# Altium project Isolation_Board_L1.PrjPcb
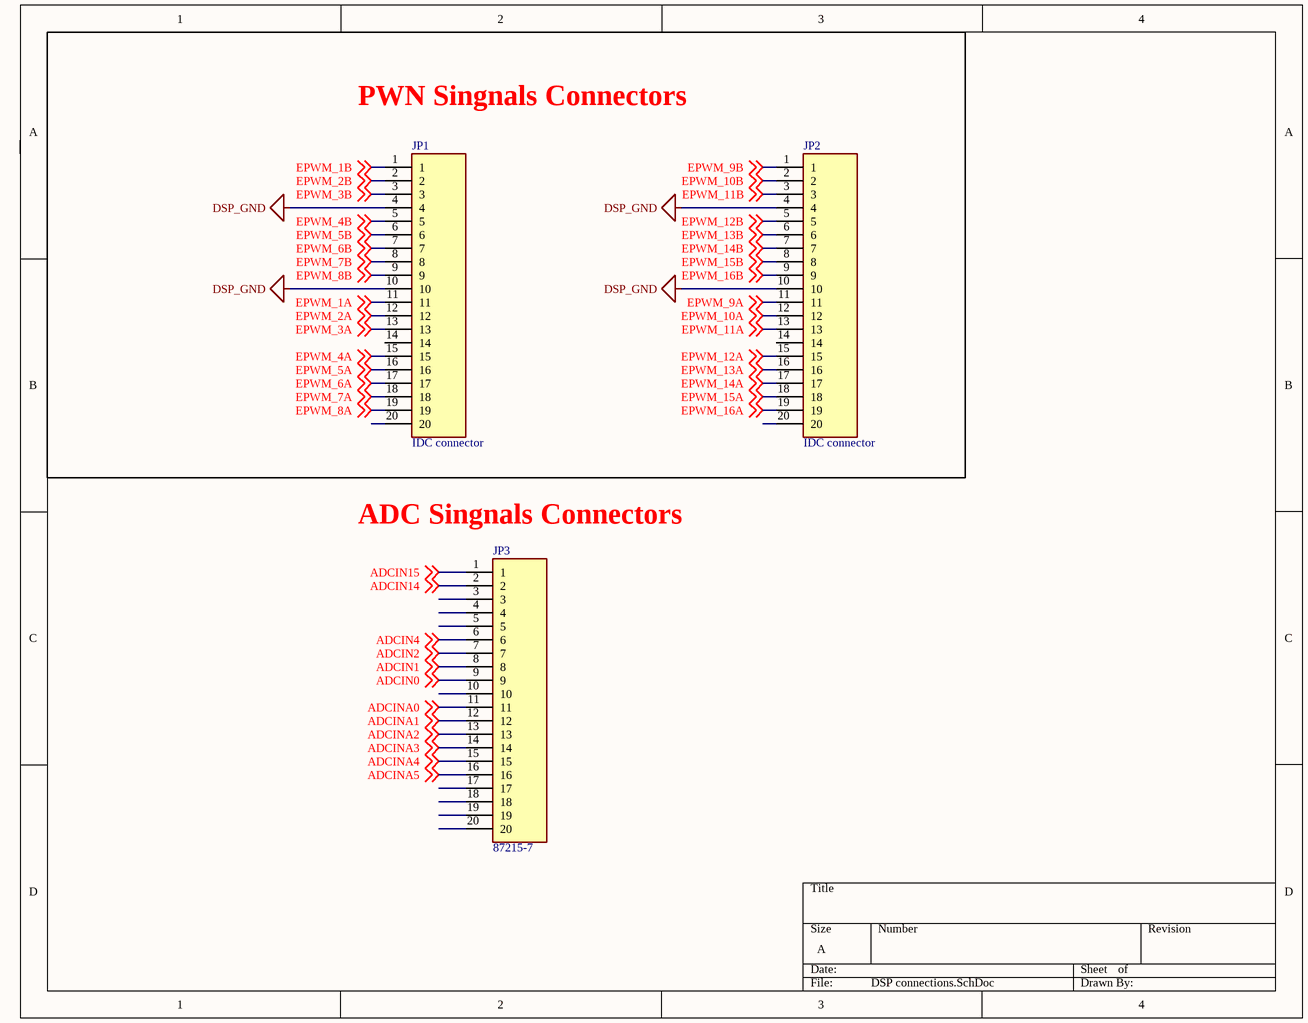
[diagram p0: DSP connections.SchDoc]
7 sheets, 128 parts. Net scope: global (net labels, ports and power ports of the same name join across sheets).
Board file: Isolation_Board.PcbDoc
Sheets:
  Assembly.SchDoc
  DSP connections.SchDoc
  Buck_Converters.SchDoc
  Voltage_Protection.SchDoc
  ADC_LEVEL_SHIFT.SchDoc
  Opto-Isolation_1.SchDoc
  Opto-Isolation_2.SchDoc

## Sheet Assembly.SchDoc
size A3; SheetNumber: 1; SheetTotal: 7

## Sheet DSP connections.SchDoc
size A; SheetNumber: 2; SheetTotal: 6

### Parts
JP1  IDC connector  [TE_87215-7]
JP2  IDC connector  [TE_87215-7]
JP3  87215-7  [TE_87215-7]

### Blocks framed on the sheet
PWN Singnals Connectors: JP1 JP2

### Nets
DSP_GND: JP1.4 JP1.10 JP2.4 JP2.10
ADCIN0: JP3.9 ; off-sheet ADCIN0
ADCIN1: JP3.8 ; off-sheet ADCIN1
ADCIN2: JP3.7 ; off-sheet ADCIN2
ADCIN4: JP3.6 ; off-sheet ADCIN4
ADCIN14: JP3.2 ; off-sheet ADCIN14
ADCIN15: JP3.1 ; off-sheet ADCIN15
ADCINA0: JP3.11 ; off-sheet ADCINA0
ADCINA1: JP3.12 ; off-sheet ADCINA1
ADCINA2: JP3.13 ; off-sheet ADCINA2
ADCINA3: JP3.14 ; off-sheet ADCINA3
ADCINA4: JP3.15 ; off-sheet ADCINA4
ADCINA5: JP3.16 ; off-sheet ADCINA5
EPWM_1A: JP1.11 ; off-sheet EPWM_1A
EPWM_1B: JP1.1 ; off-sheet EPWM_1B
EPWM_2A: JP1.12 ; off-sheet EPWM_2A
EPWM_2B: JP1.2 ; off-sheet EPWM_2B
EPWM_3A: JP1.13 ; off-sheet EPWM_3A
EPWM_3B: JP1.3 ; off-sheet EPWM_3B
EPWM_4A: JP1.15 ; off-sheet EPWM_4A
EPWM_4B: JP1.5 ; off-sheet EPWM_4B
EPWM_5A: JP1.16 ; off-sheet EPWM_5A
EPWM_5B: JP1.6 ; off-sheet EPWM_5B
EPWM_6A: JP1.17 ; off-sheet EPWM_6A
EPWM_6B: JP1.7 ; off-sheet EPWM_6B
EPWM_7A: JP1.18 ; off-sheet EPWM_7A
EPWM_7B: JP1.8 ; off-sheet EPWM_7B
EPWM_8A: JP1.19 ; off-sheet EPWM_8A
EPWM_8B: JP1.9 ; off-sheet EPWM_8B
EPWM_9A: JP2.11 ; off-sheet EPWM_9A
EPWM_9B: JP2.1 ; off-sheet EPWM_9B
EPWM_10A: JP2.12 ; off-sheet EPWM_10A
EPWM_10B: JP2.2 ; off-sheet EPWM_10B
EPWM_11A: JP2.13 ; off-sheet EPWM_11A
EPWM_11B: JP2.3 ; off-sheet EPWM_11B
EPWM_12A: JP2.15 ; off-sheet EPWM_12A
EPWM_12B: JP2.5 ; off-sheet EPWM_12B
EPWM_13A: JP2.16 ; off-sheet EPWM_13A
EPWM_13B: JP2.6 ; off-sheet EPWM_13B
EPWM_14A: JP2.17 ; off-sheet EPWM_14A
EPWM_14B: JP2.7 ; off-sheet EPWM_14B
EPWM_15A: JP2.18 ; off-sheet EPWM_15A
EPWM_15B: JP2.8 ; off-sheet EPWM_15B
EPWM_16A: JP2.19 ; off-sheet EPWM_16A
EPWM_16B: JP2.9 ; off-sheet EPWM_16B

Not connected (* = marked no-connect by the designer): JP1 14 20; JP2 14 20; JP3 3 4 5 10 17 18 19 20

### Notes on the sheet
- (near JP3) ADC Singnals Connectors

### Library data of the parts
JP1-JP3 = 87215-7: 20 MODII HDR DRST UNSHRD .100; MF: TE Connectivity; Value: *; Price: None; Availability: Unavailable; SnapEDA_Link: https://www.snapeda.com/parts/87215-7/TE%20Connectivity/view-part/283412/?ref=snap; Package: None; MP: 87215-7

## Sheet Buck_Converters.SchDoc
size A; SheetNumber: 2; SheetTotal: 6
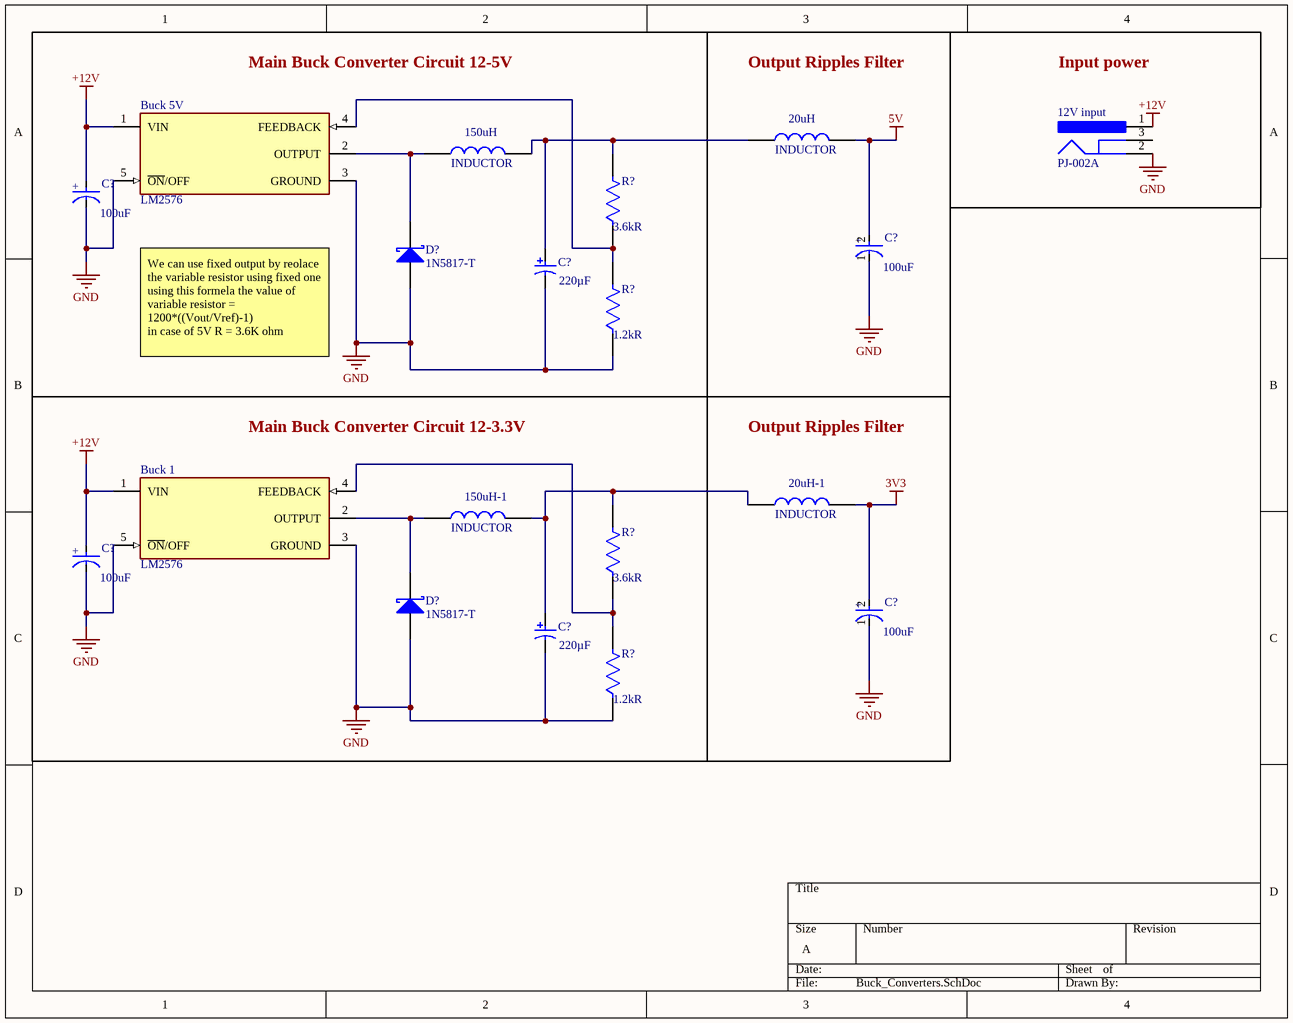
[diagram p1: Buck_Converters.SchDoc]

### Parts
(Parts that share a designator on the sheet are numbered #1, #2 ... from top to bottom, then left to right.)
12V_input  PJ-002A  [CUI-PJ-002A_V]
20uH  INDUCTOR  [AXIAL0.3]
20uH-1  INDUCTOR  [AXIAL0.3]
150uH  INDUCTOR  [AXIAL0.3]
150uH-1  INDUCTOR  [AXIAL0.3]
Buck_1  LM2576  [FP-C04-036-MFG]
Buck_5V  LM2576  [FP-C04-036-MFG]
C?#1  Capacitance: 100uF  [FP-RAD-TH-D_6_3_0_5-L_7_1-MFG]  (hidden comment: ECEA1CKA101I)
C?#2  Capacitance: 100uF  [FP-RAD-TH-D_6_3_0_5-L_7_1-MFG]  (hidden comment: ECEA1CKA101I)
C?#3  Capacitance: 220µF  [PNSC-ECA-1VM221-2]  (hidden comment: ECA-1VM221)
C?#4  Capacitance: 100uF  [FP-RAD-TH-D_6_3_0_5-L_7_1-MFG]  (hidden comment: ECEA1CKA101I)
C?#5  Capacitance: 100uF  [FP-RAD-TH-D_6_3_0_5-L_7_1-MFG]  (hidden comment: ECEA1CKA101I)
C?#6  Capacitance: 220µF  [PNSC-ECA-1VM221-2]  (hidden comment: ECA-1VM221)
D?#1  1N5817-T  [DIOD-DO-41-P-2]
D?#2  1N5817-T  [DIOD-DO-41-P-2]
R?#1  Resistance: 3.6kR  [FP-MRS25-MFG]  (hidden comment: MRS25000C1001FCT00)
R?#2  Resistance: 1.2kR  [FP-MRS25-MFG]  (hidden comment: MRS25000C1001FCT00)
R?#3  Resistance: 3.6kR  [FP-MRS25-MFG]  (hidden comment: MRS25000C1001FCT00)
R?#4  Resistance: 1.2kR  [FP-MRS25-MFG]  (hidden comment: MRS25000C1001FCT00)

### Nets
3V3: 20uH-1.2 C?#5.2(A)
5V: 20uH.2 C?#2.2(A)
+12V: 12V_input.1 Buck_1.1(VIN) Buck_5V.1(VIN) C?#1.2(A) C?#4.2(A)
GND: 12V_input.2 Buck_1.3(GROUND) Buck_1.5(~{ON}/OFF) Buck_5V.3(GROUND) Buck_5V.5(~{ON}/OFF) C?#1.1(C) C?#2.1(C) C?#3.2 C?#4.1(C) C?#5.1(C) C?#6.2 D?#1.1(A) D?#2.1(A) R?#2.1 R?#4.1
Net20uH-1_1: 20uH-1.1 150uH-1.2 C?#6.1 R?#3.2
Net20uH_1: 20uH.1 150uH.2 C?#3.1 R?#1.2
Net150uH-1_1: 150uH-1.1 Buck_1.2(OUTPUT) D?#2.2(K)
Net150uH_1: 150uH.1 Buck_5V.2(OUTPUT) D?#1.2(K)
NetBuck_1_4: Buck_1.4(FEEDBACK) R?#3.1 R?#4.2
NetBuck_5V_4: Buck_5V.4(FEEDBACK) R?#1.1 R?#2.2

Not connected (* = marked no-connect by the designer): 12V_input 3

### Notes on the sheet
- Main Buck Converter Circuit 12-5V
- Output Ripples Filter
- Input power
- We can use fixed output by reolace the variable resistor using fixed one
  using this formela the value of variable resistor = 1200*((Vout/Vref)-1)
  in case of 5V R = 3.6K ohm
- Main Buck Converter Circuit 12-3.3V
- (in symbol CMP-05427-001316-1) +

### Library data of the parts
12V_input = CMP-2000-06895-2: Through Hole Right Angle DC Power Jack, 2.5 A, 2 mm Center Pin, 3 Position, -25 to 85 degC, RoHS, Bulk; Manufacturer: CUIInc.; Brand: CUI; Inside Contact Diameter: 2mm; Voltage Rating: 24V; Outside Contact Diameter: 6.5mm; Current Rating: 2.5A; Insulation Resistance: 50MOhms; Contact Gender: Male; Connector Type: DCPowerJack; Datasheet Version: Rev. 1.03, 04/2016; Housing Material: PolybutyleneTerephthalate(PBT); Operating Temperature Range: -25Cto+85C; Termination Style: ThroughHole; Product Category: DCPowerConnectors; Mounting Technology: ThroughHole; Mounting Style: ThroughHole; Factory Pack Quantity: 500; Contact Plating: Nickel; Package Reference: PJ-002A; Mounting Angle: Right; Package Description: 3-Pin Through Hole Device, Body 14.4 x 9 mm, Height 11 mm; Flammability Rating: UL94V-0; Manufacturer URL: http://www.cui.com/; Product: Jacks; Contact Material: Copper; Datasheet URL: http://www.cui.com/product/resource/pj-002a.pdf; RoHS: True
Buck_1 Buck_5V = CMP-06325-000071-1: IC REG BUCK 5V 3A TO220-5; Min Input Voltage: 4V; Switching Frequency: 52kHz; Efficiency: 82%; Number of Outputs: 1; Output Type: Fixed; Output Configuration: Positive; Max Input Voltage: 40V; Synchronous Rectifier: No; Nominal Output Voltage: 5V; Number of Pins: 5; Lead Free: Lead Free; Width: 4.83mm; Min Operating Temperature: -40°C; Switching Frequency-Max: 52kHz; Mount: Through Hole; Package Quantity: 50; Max Operating Temperature: 85°C; Output Current: 3A; Height: 9.17mm; Radiation Hardening: No; Case/Package: TO-220; Output Voltage: 5V; RoHS Compliant: Yes; Length: 10.67mm; Series: -; Min Output Voltage: 5V; Packaging: Rail/Tube; Max Output Current: 3A; Reach SVHC Compliant: Yes
C?#1 C?#2 C?#4 C?#5 = CMP-05427-001316-1: Aluminum Electrolytic Capacitors (Radial Lead Type) 100uF ±20% 16V; Life (Hours): 1000Hour; Lead Diameter: 0.45mm; Polarity: Polar; Ripple Current: 91mA; Series: KA; Packaging: Tape and Reel; Voltage Rating: 16V; Voltage Rating (DC): 16V; Min Operating Temperature: -40°C; Lead Pitch: 2.5mm; Mount: Through Hole; Height - Seated (Max): 0.315inch; Package Quantity: 2000; Length: 7mm; Termination: Radial; Voltage: 16V; Diameter: 6.3mm; Height: 7mm; Radiation Hardening: No; RoHS Compliant: Yes; Tolerance: 20%; Case/Package: Radial; Max Operating Temperature: 85°C
C?#3 C?#6 = CMP-2000-05311-1: Aluminum Electrolytic Capacitor, 220 uF, +/- 20%, 35 V, -40 to 85 degC, 2-Pin THD, RoHS, Bulk; Manufacturer: Panasonic; Lifetime@Temperature: 2000Hrs@85degC; Rated Voltage: 35V; Ripple Current: 350mA; Type: Radial; Package Reference: ECA-1VM221; Series: M; Operating Temp Range: -40to+85degC; Package Description: 2-Pin Axial Lead, Dia 8 mm, Body Length 12.5 mm; Datasheet Version: Mar-06; Datasheet URL: https://datasheet.ciiva.com/26341/441851-da-01-en-elko-eca1vm221-m-r-220myf-35v-85c-26341906.pdf; Operating Temp-Max: 85degC; Case Size/Dimension: Ø8x11.5mm; Manufacturer URL: http://www.panasonic.com/
D?#1 D?#2 = CMP-2000-05521-1: Schottky Barrier Rectifier, 1 A, 20 V, -65 to 125 degC, 2-Pin DO-41, RoHS, Tape and Reel; Manufacturer: DiodesIncorporated; Vrrm - Repetitive Reverse Voltage: 20V; If - Forward Current: 1A; Configuration: Single; Unit Weight: 0.010582oz; Type: SchottkyDiode; Ifsm - Forward Surge Current: 25A; Vf - Forward Voltage: 0.75Vat3A; Ir - Reverse Current: 1000uA; Technology: Si; Length: 5.21mm; Product: SchottkyRectifiers; Package Reference: DO-41-P-2; Package / Case: DO-41; Datasheet URL: http://www.diodes.com/_files/datasheets/ds23001.pdf; Operating Temperature Range: -65Cto+125C; Mounting Style: ThroughHole; Manufacturer URL: http://www.diodes.com/; Series: 1N58; Minimum Operating Temperature: -65C; Height: 2.72mm; Brand: DiodesIncorporated; Maximum Operating Temperature: +125C; Datasheet Version: Rev. 8-2, 05/2009; Factory Pack Quantity: 5000; Width: 2.72mm; RoHS: True; Product Category: SchottkyDiodes&Rectifiers; Package Description: 2-Pin Through Hole Device, Body 4.635 x 2.36 mm, Pin Spacing 7.85 mm; Packaging: Reel; Termination Style: ThroughHole; Mounting Technology: ThroughHole
R?#1-R?#4 = CMP-02408-000051-1: RES 1K OHM 0.6W 1% AXIAL; Power Rating: 600mW; Lead Diameter: 0.6mm; Voltage Rating (DC): 350V; Temperature Coefficient: 50ppm/°C; Width: 2.5mm; Military Standard: Not; Package Quantity: 5000; Radiation Hardening: No; Case/Package: Axial; Resistance Tolerance: 1%; Resistor Type: Metal Film; Contact Plating: Tin; Length: 6.5mm; Lead Free: Lead Free; RoHS Compliant: Yes; Mount: Through Hole; Number of Pins: 2; Technology: THIN FILM; Voltage Rating: 350V; Min Operating Temperature: -55°C; Weight: 0.00776oz; Diameter: 2.5mm; Construction: Cylindrical; Series: MRS25; Tolerance: 1%; Packaging: Tape and Reel; Max Operating Temperature: 155°C; Max Power Dissipation: 600mW; Number of Terminations: 2; Termination: Axial

## Sheet Voltage_Protection.SchDoc
size 381 x 241 mm; SheetNumber: 4; SheetTotal: 6
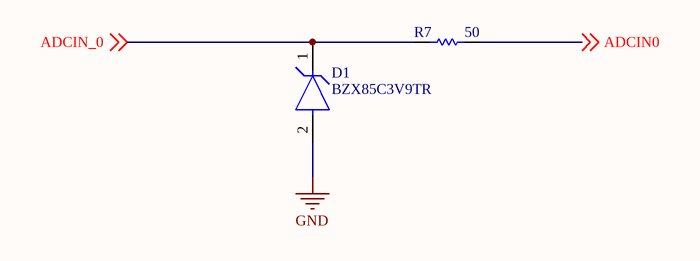
[diagram p2: Voltage_Protection.SchDoc]

### Parts
D1  BZX85C3V9TR  [FP-017AH-MFG]
R7  value 50  (hidden comment: Resistor)

### Nets
GND: D1.2(A)
ADCIN0: R7.2 ; off-sheet ADCIN0
ADCIN_0: D1.1(C) R7.1 ; off-sheet ADCIN_0

### Library data of the parts
D1 = CMP-00278-00328084-1: BZX85C3V9TR Tape & Reel (TR) ±5% Through Hole Single Zener Diode 1.2V @ 200mA 5muA @ 1V 1W 3.9V; NexarPartId: 328084; Zener Current: 60mA; Impedance: 15Ω; Max Reverse Leakage Current: 5µA; Packaging: Tape & Reel; Power Dissipation: 1W; Test Current: 60mA; Tolerance: 5%; Lead Free: Lead Free; Zener Voltage: 3.9V; Voltage Tolerance: 5%; Power Rating: 1W; Number of Pins: 2; Mount: Through Hole; Radiation Hardening: No; Min Operating Temperature: -65°C; Element Configuration: Single; Max Operating Temperature: 200°C; RoHS: Compliant; Voltage Rating (DC): 3.9V; Max Power Dissipation: 1W
R7 = Resistor: TC1: 0; SimulationGenericComponent: True; TC2: 0

## Sheet ADC_LEVEL_SHIFT.SchDoc
size A4; Author: Mostafa_Bakir; SheetNumber: 5; SheetTotal: 6
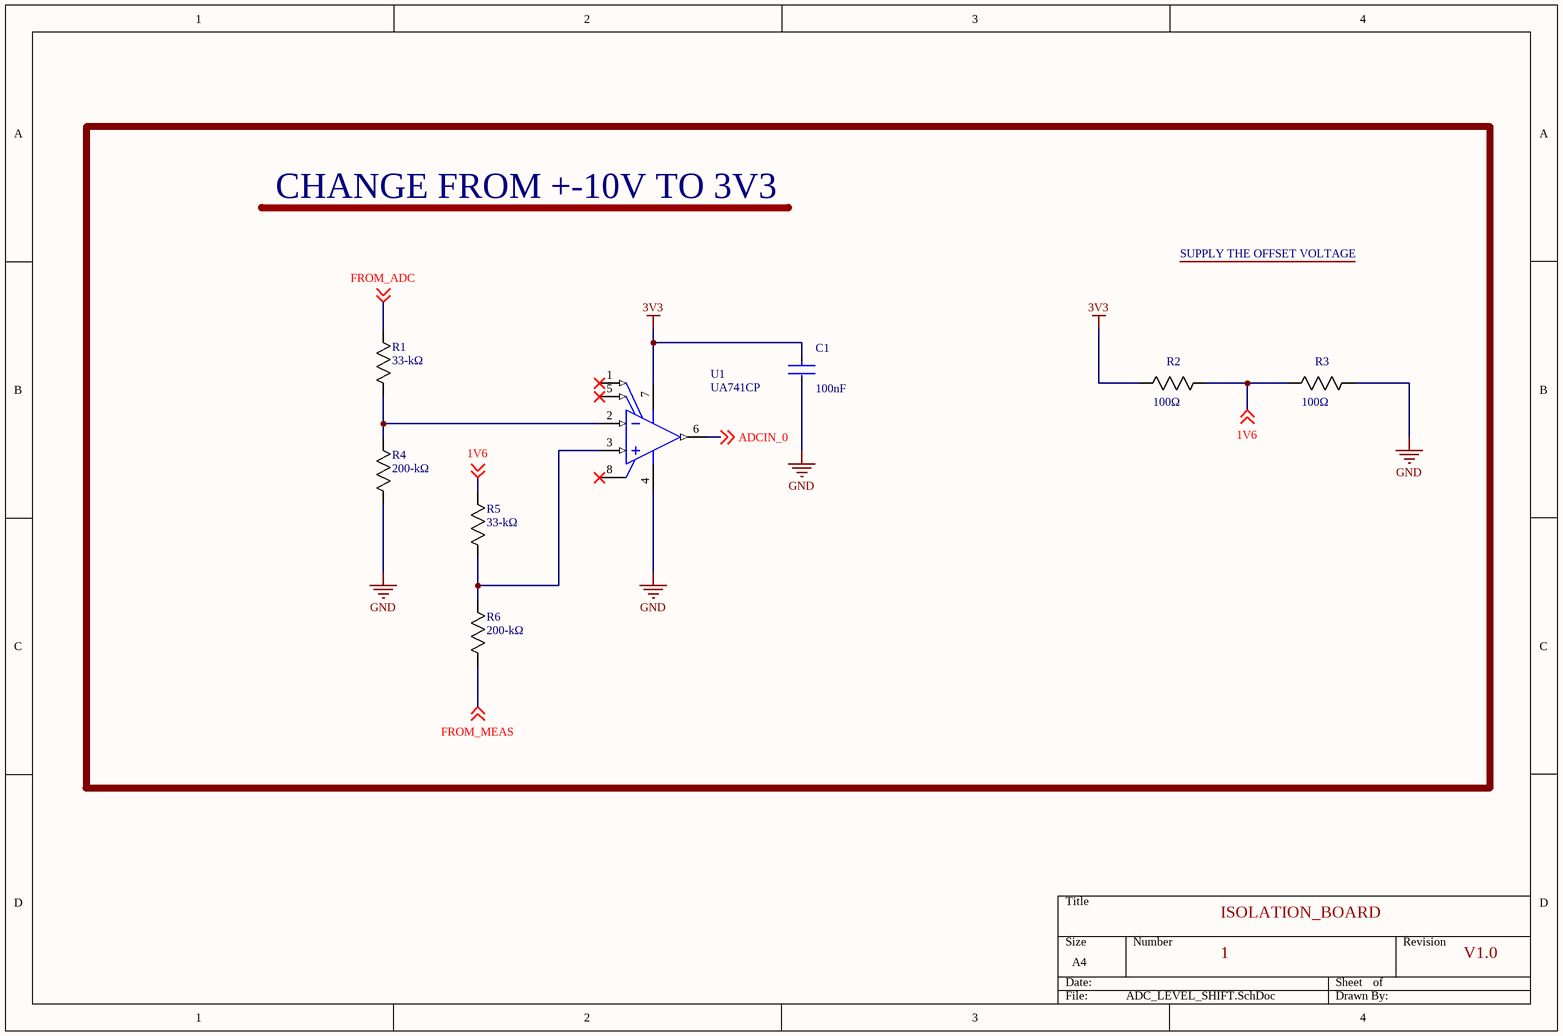
[diagram p3: ADC_LEVEL_SHIFT.SchDoc]

### Parts
C1  Capacitance: 100nF  [FP-K15H5-MFG]  (hidden comment: K104K15X7RF53H5)
R1  Resistance: 33-kΩ  [RES_AC03_VIS]  (hidden comment: AC03000008208JAC00)
R2  Resistance: 100Ω  [RES_AC03_VIS]  (hidden comment: AC03000008208JAC00)
R3  Resistance: 100Ω  [RES_AC03_VIS]  (hidden comment: AC03000008208JAC00)
R4  Resistance: 200-kΩ  [RES_AC03_VIS]  (hidden comment: AC03000008208JAC00)
R5  Resistance: 33-kΩ  [RES_AC03_VIS]  (hidden comment: AC03000008208JAC00)
R6  Resistance: 200-kΩ  [RES_AC03_VIS]  (hidden comment: AC03000008208JAC00)
U1  UA741CP  [P0008A]

### Nets
3V3: C1.1 R2.1 U1.7(VCC+)
GND: C1.2 R3.2 R4.1 U1.4(VCC-)
1V6: R2.2 R3.1 R5.2 ; off-sheet 1V6
ADCIN_0: U1.6(OUT) ; off-sheet ADCIN_0
FROM_ADC: R1.2 ; off-sheet FROM_ADC
FROM_MEAS: R6.1 ; off-sheet FROM_MEAS
NetR1_1: R1.1 R4.2 U1.2(IN-)
NetR5_1: R5.1 R6.2 U1.3(IN+)

Not connected (* = marked no-connect by the designer): U1 1(OFFSET_N1)* 5(OFFSET_N2)* 8(NC)*

### Notes on the sheet
- CHANGE FROM +-10V TO 3V3
- SUPPLY THE OFFSET VOLTAGE
- ISOLATION_BOARD
- 1
- V1.0

### Library data of the parts
C1 = CMP-02417-000048-1: CAP CER 0.1UF 50V X7R RADIAL; Tolerance: 10%; Lead/Base Style: Formed Leads; Lead Length: 30mm; Lead Diameter: 0.5mm; Radiation Hardening: No; Lead Pitch: 5mm; Voltage: 50V; Mount: Through Hole; Package Quantity: 5000; Series: K; Case/Package: Dipped; Min Operating Temperature: -55°C; Depth: 2.5mm; Height - Seated (Max): 0.1inch; Voltage Rating (DC): 50V; Packaging: Bulk; RoHS Compliant: Yes; Construction: RADIAL; Thickness: 2.6mm; Max Operating Temperature: 125°C; Voltage Rating: 50V; Diameter: 500um; Dielectric: X7R; Width: 2.5mm; Length: 4mm; Weight: 0.005644oz; Termination: Radial; Height: 4mm; ComponentLink1Description: BUY; ComponentLink1URL: https://makerselectronics.com/product/ceramic-capacitor-100nf-50v
R1-R6 = CMP-00030-43026420-1: AC03000008208JAC00 AC03 Series Axial Wirewound Resistor 8.2Ohms +/-5% 3W -80 - -10ppm/degC; Tolerance: 5%; Temperature Coefficient: -10ppm/°C; Thickness: 4.8006mm; Radiation Hardening: No; Min Operating Temperature: -40°C; Case/Package: Axial; Packaging: Tape & Box (TB); Termination: Axial; Power Rating: 3W; Width: 4.8006mm; Military Standard: Not; Diameter: 4.8mm; RoHS: Compliant; Contact Plating: Tin; NexarPartId: 43026420; Composition: Wirewound; Features: Flame Retardant Coating; Number of Terminations: 2; Length: 13mm; Max Power Dissipation: 3W; Mount: Through Hole; Max Operating Temperature: 200°C
U1 = CMP-0017-00973-2: General-Purpose Operational Amplifier, 7 to 36 V, 0 to 70 degC, 8-pin DIP (P8), Pb-Free (RoHS); Manufacturer: Texas Instruments; Iq per channel(Max)(mA): 2.8; Number of Channels: 1; Total Supply Voltage(Min)(+5V is 5, +/-5V is 10): 7; IIB(Max)(pA): 800000; Slew Rate(Typ)(V/us): 0.5; Total Supply Voltage(Max)(+5V is 5, +/-5V is 10): 36; Vio (25C)(Max)(mV): 6; CMRR(Min)(dB): 70; Sub Family: General Purpose Amplifier, High Supply Voltage Amplifier (>=30V); PackageVersion: 4040082/E, 04/2010; PackageReference: P0008A; ComponentLink1URL: http://www.ti.com/; Mounting Technology: Through Hole; ComponentLink1Description: Manufacturer URL; GBW(Typ)(MHz): 1; ComponentLink2Description: Datasheet; ComponentLink2URL: http://www.ti.com/lit/ds/symlink/ua741.pdf; PartNumber: UA741CP; Code_JEDEC: MS-001; ComponentLink3Description: Package Specification; DatasheetVersion: SLOS094B; ComponentLink3URL: http://www.ti.com/litv/pdf/mpdi001b; PackageDescription: 8-Pin Plastic In-Line, Body 9.59 x 6.35 mm, Pitch 2.54 mm; Eco-Plan: Pb-Free (RoHS); ComponentLink4Description: BUY; ComponentLink4URL: https://makerselectronics.com/product/ua741

## Sheet Opto-Isolation_1.SchDoc
size A2 portrait; SheetNumber: 6; SheetTotal: 6
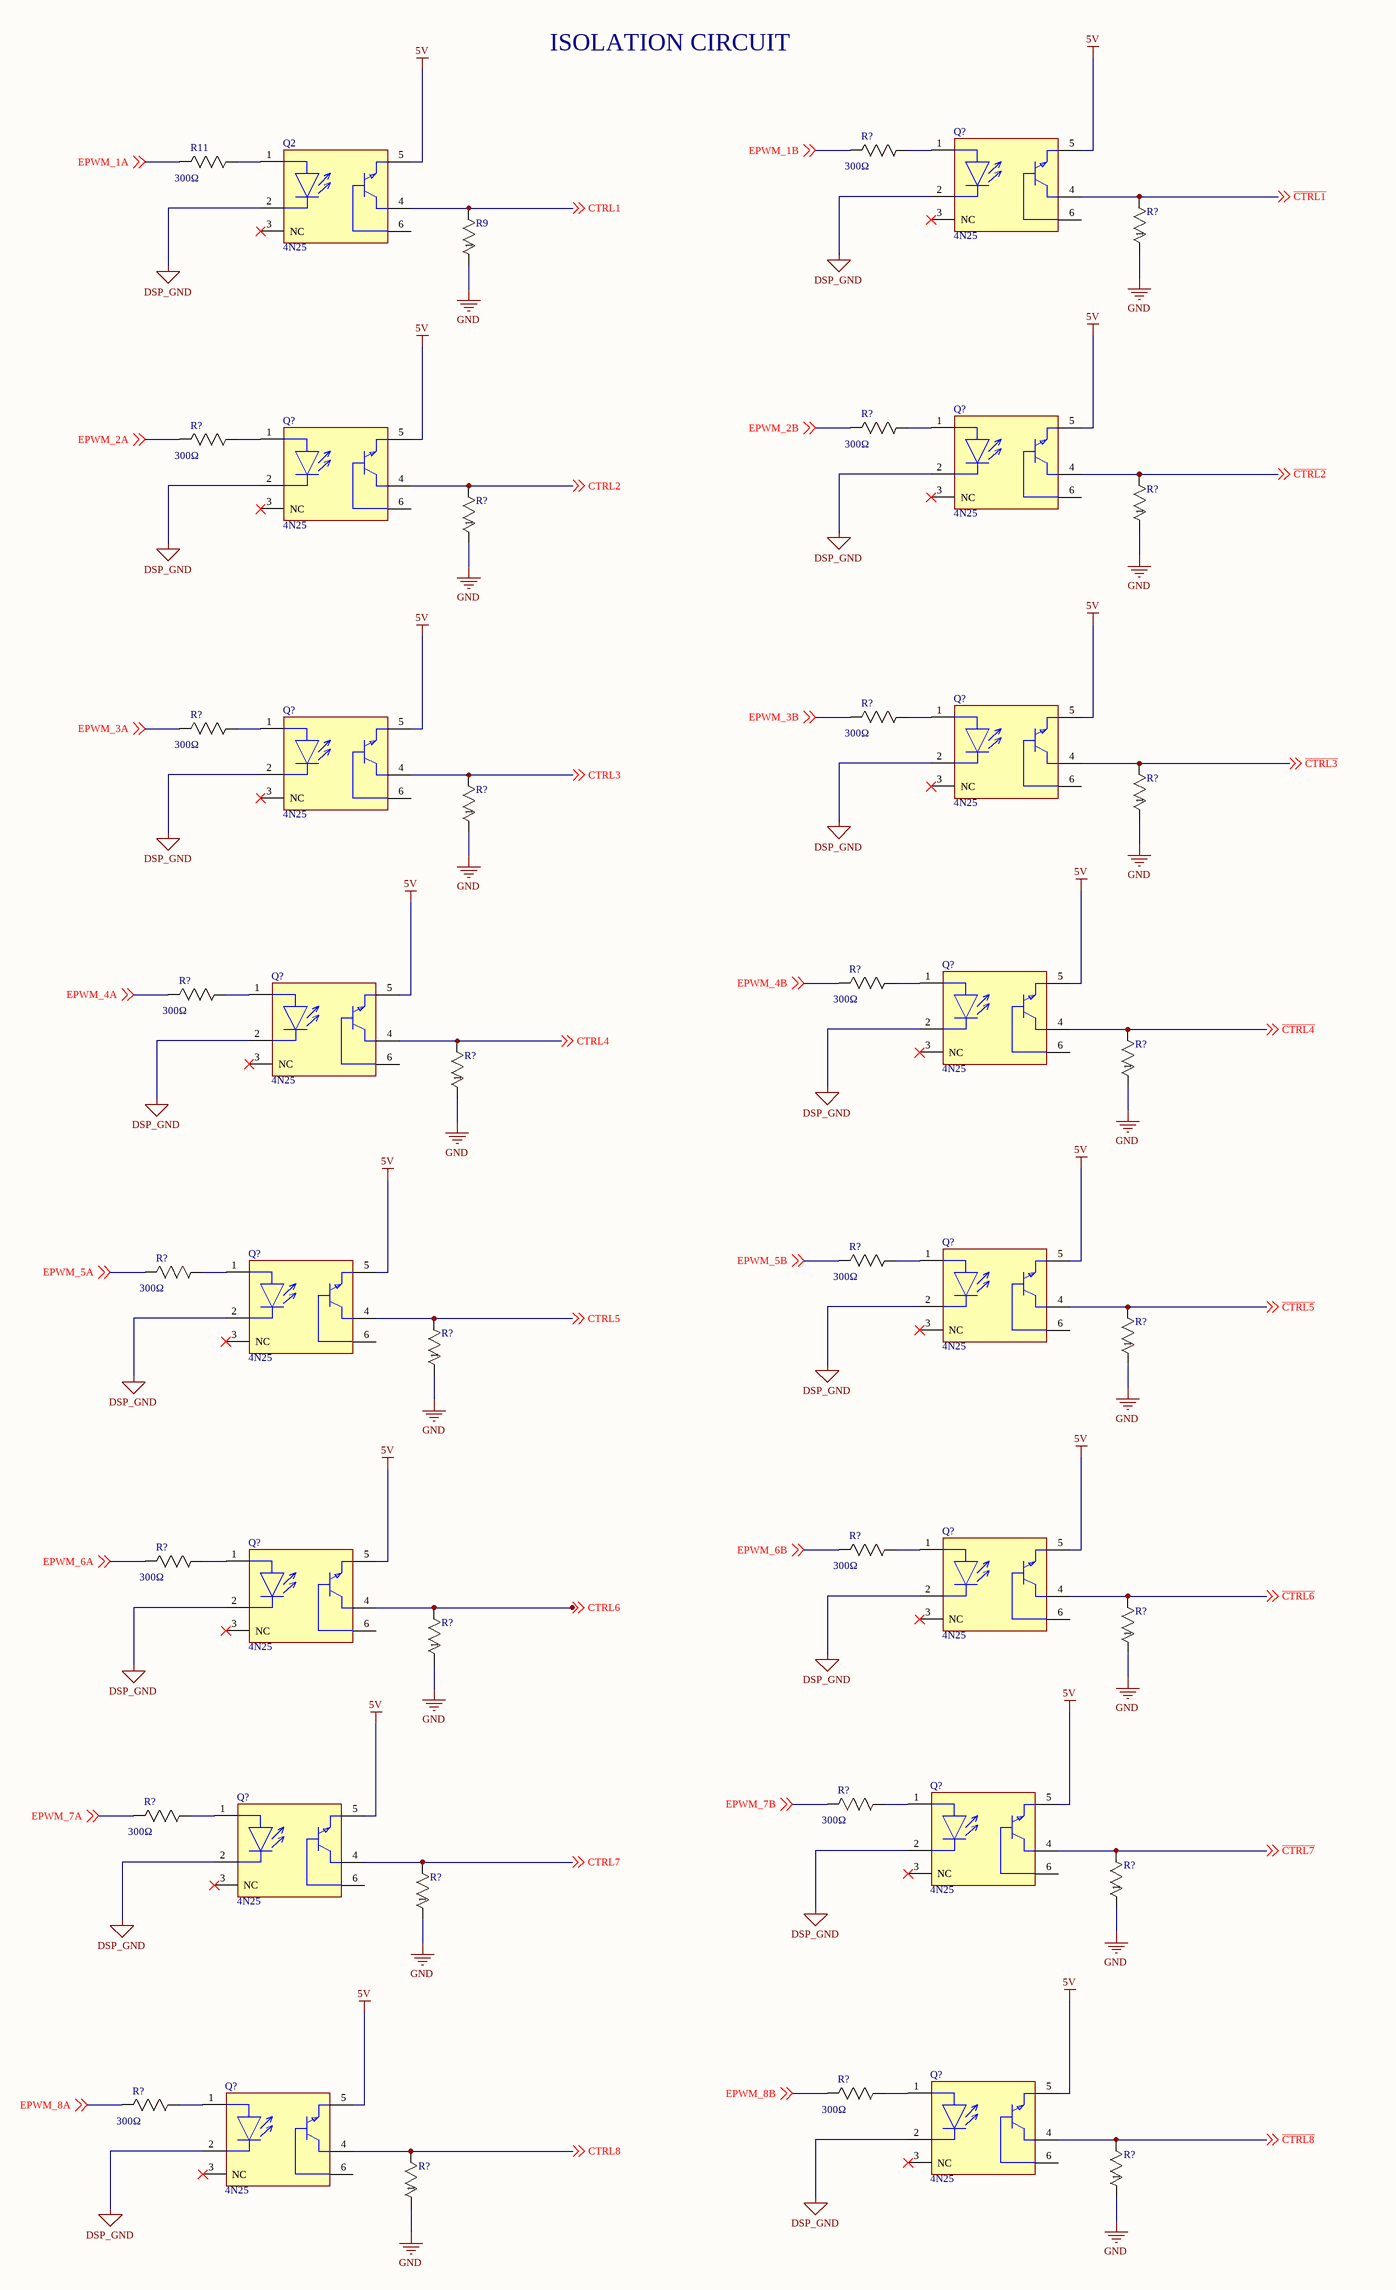
[diagram p4: Opto-Isolation_1.SchDoc]

### Parts
(Parts that share a designator on the sheet are numbered #1, #2 ... from top to bottom, then left to right.)
Q2  4N25  [FP-4N25-MFG]
Q?#1  4N25  [FP-4N25-MFG]
Q?#2  4N25  [FP-4N25-MFG]
Q?#3  4N25  [FP-4N25-MFG]
Q?#4  4N25  [FP-4N25-MFG]
Q?#5  4N25  [FP-4N25-MFG]
Q?#6  4N25  [FP-4N25-MFG]
Q?#7  4N25  [FP-4N25-MFG]
Q?#8  4N25  [FP-4N25-MFG]
Q?#9  4N25  [FP-4N25-MFG]
Q?#10  4N25  [FP-4N25-MFG]
Q?#11  4N25  [FP-4N25-MFG]
Q?#12  4N25  [FP-4N25-MFG]
Q?#13  4N25  [FP-4N25-MFG]
Q?#14  4N25  [FP-4N25-MFG]
Q?#15  4N25  [FP-4N25-MFG]
R9  AC07000001001JAC00  [RES_AC07_VIS]  (value not drawn)
R11  Resistance: 300Ω  [RES_AC03_VIS]  (hidden comment: AC03000003000JAC00)
R?#5  Resistance: 300Ω  [RES_AC03_VIS]  (hidden comment: AC03000003000JAC00)
R?#6  AC07000001001JAC00  [RES_AC07_VIS]  (value not drawn)
R?#7  Resistance: 300Ω  [RES_AC03_VIS]  (hidden comment: AC03000003000JAC00)
R?#8  Resistance: 300Ω  [RES_AC03_VIS]  (hidden comment: AC03000003000JAC00)
R?#9  AC07000001001JAC00  [RES_AC07_VIS]  (value not drawn)
R?#10  AC07000001001JAC00  [RES_AC07_VIS]  (value not drawn)
R?#11  Resistance: 300Ω  [RES_AC03_VIS]  (hidden comment: AC03000003000JAC00)
R?#12  Resistance: 300Ω  [RES_AC03_VIS]  (hidden comment: AC03000003000JAC00)
R?#13  AC07000001001JAC00  [RES_AC07_VIS]  (value not drawn)
R?#14  AC07000001001JAC00  [RES_AC07_VIS]  (value not drawn)
R?#15  Resistance: 300Ω  [RES_AC03_VIS]  (hidden comment: AC03000003000JAC00)
R?#16  Resistance: 300Ω  [RES_AC03_VIS]  (hidden comment: AC03000003000JAC00)
R?#17  AC07000001001JAC00  [RES_AC07_VIS]  (value not drawn)
R?#18  AC07000001001JAC00  [RES_AC07_VIS]  (value not drawn)
R?#19  Resistance: 300Ω  [RES_AC03_VIS]  (hidden comment: AC03000003000JAC00)
R?#20  Resistance: 300Ω  [RES_AC03_VIS]  (hidden comment: AC03000003000JAC00)
R?#21  AC07000001001JAC00  [RES_AC07_VIS]  (value not drawn)
R?#22  AC07000001001JAC00  [RES_AC07_VIS]  (value not drawn)
R?#23  Resistance: 300Ω  [RES_AC03_VIS]  (hidden comment: AC03000003000JAC00)
R?#24  Resistance: 300Ω  [RES_AC03_VIS]  (hidden comment: AC03000003000JAC00)
R?#25  AC07000001001JAC00  [RES_AC07_VIS]  (value not drawn)
R?#26  AC07000001001JAC00  [RES_AC07_VIS]  (value not drawn)
R?#27  Resistance: 300Ω  [RES_AC03_VIS]  (hidden comment: AC03000003000JAC00)
R?#28  Resistance: 300Ω  [RES_AC03_VIS]  (hidden comment: AC03000003000JAC00)
R?#29  AC07000001001JAC00  [RES_AC07_VIS]  (value not drawn)
R?#30  AC07000001001JAC00  [RES_AC07_VIS]  (value not drawn)
R?#31  Resistance: 300Ω  [RES_AC03_VIS]  (hidden comment: AC03000003000JAC00)
R?#32  Resistance: 300Ω  [RES_AC03_VIS]  (hidden comment: AC03000003000JAC00)
R?#33  AC07000001001JAC00  [RES_AC07_VIS]  (value not drawn)
R?#34  AC07000001001JAC00  [RES_AC07_VIS]  (value not drawn)

### Nets
5V: Q2.5(C) Q?#1.5(C) Q?#2.5(C) Q?#3.5(C) Q?#4.5(C) Q?#5.5(C) Q?#6.5(C) Q?#7.5(C) Q?#8.5(C) Q?#9.5(C) Q?#10.5(C) Q?#11.5(C) Q?#12.5(C) Q?#13.5(C) Q?#14.5(C) Q?#15.5(C)
DSP_GND: Q2.2(C) Q?#1.2(C) Q?#2.2(C) Q?#3.2(C) Q?#4.2(C) Q?#5.2(C) Q?#6.2(C) Q?#7.2(C) Q?#8.2(C) Q?#9.2(C) Q?#10.2(C) Q?#11.2(C) Q?#12.2(C) Q?#13.2(C) Q?#14.2(C) Q?#15.2(C)
GND: R9.1 R?#6.1 R?#9.1 R?#10.1 R?#13.1 R?#14.1 R?#17.1 R?#18.1 R?#21.1 R?#22.1 R?#25.1 R?#26.1 R?#29.1 R?#30.1 R?#33.1 R?#34.1
~{CTRL1}: Q?#1.4(E) R?#6.2 ; off-sheet ~{CTRL1}
~{CTRL2}: Q?#2.4(E) R?#9.2 ; off-sheet ~{CTRL2}
~{CTRL3}: Q?#4.4(E) R?#13.2 ; off-sheet ~{CTRL3}
~{CTRL4}: Q?#6.4(E) R?#17.2 ; off-sheet ~{CTRL4}
~{CTRL5}: Q?#8.4(E) R?#21.2 ; off-sheet ~{CTRL5}
~{CTRL6}: Q?#10.4(E) R?#25.2 ; off-sheet ~{CTRL6}
~{CTRL7}: Q?#12.4(E) R?#29.2 ; off-sheet ~{CTRL7}
~{CTRL8}: Q?#14.4(E) R?#33.2 ; off-sheet ~{CTRL8}
CTRL1: Q2.4(E) R9.2 ; off-sheet CTRL1
CTRL2: Q?#3.4(E) R?#10.2 ; off-sheet CTRL2
CTRL3: Q?#5.4(E) R?#14.2 ; off-sheet CTRL3
CTRL4: Q?#7.4(E) R?#18.2 ; off-sheet CTRL4
CTRL5: Q?#9.4(E) R?#22.2 ; off-sheet CTRL5
CTRL6: Q?#11.4(E) R?#26.2 ; off-sheet CTRL6
CTRL7: Q?#13.4(E) R?#30.2 ; off-sheet CTRL7
CTRL8: Q?#15.4(E) R?#34.2 ; off-sheet CTRL8
EPWM_1A: R11.1 ; off-sheet EPWM_1A
EPWM_1B: R?#5.1 ; off-sheet EPWM_1B
EPWM_2A: R?#8.1 ; off-sheet EPWM_2A
EPWM_2B: R?#7.1 ; off-sheet EPWM_2B
EPWM_3A: R?#12.1 ; off-sheet EPWM_3A
EPWM_3B: R?#11.1 ; off-sheet EPWM_3B
EPWM_4A: R?#16.1 ; off-sheet EPWM_4A
EPWM_4B: R?#15.1 ; off-sheet EPWM_4B
EPWM_5A: R?#20.1 ; off-sheet EPWM_5A
EPWM_5B: R?#19.1 ; off-sheet EPWM_5B
EPWM_6A: R?#24.1 ; off-sheet EPWM_6A
EPWM_6B: R?#23.1 ; off-sheet EPWM_6B
EPWM_7A: R?#28.1 ; off-sheet EPWM_7A
EPWM_7B: R?#27.1 ; off-sheet EPWM_7B
EPWM_8A: R?#32.1 ; off-sheet EPWM_8A
EPWM_8B: R?#31.1 ; off-sheet EPWM_8B
NetQ2_1: Q2.1(A) R11.2
NetQ?#1_1: Q?#1.1(A) R?#5.2
NetQ?#2_1: Q?#2.1(A) R?#7.2
NetQ?#3_1: Q?#3.1(A) R?#8.2
NetQ?#4_1: Q?#4.1(A) R?#11.2
NetQ?#5_1: Q?#5.1(A) R?#12.2
NetQ?#6_1: Q?#6.1(A) R?#15.2
NetQ?#7_1: Q?#7.1(A) R?#16.2
NetQ?#8_1: Q?#8.1(A) R?#19.2
NetQ?#9_1: Q?#9.1(A) R?#20.2
NetQ?#10_1: Q?#10.1(A) R?#23.2
NetQ?#11_1: Q?#11.1(A) R?#24.2
NetQ?#12_1: Q?#12.1(A) R?#27.2
NetQ?#13_1: Q?#13.1(A) R?#28.2
NetQ?#14_1: Q?#14.1(A) R?#31.2
NetQ?#15_1: Q?#15.1(A) R?#32.2

Not connected (* = marked no-connect by the designer): Q2 3(NC)* 6(B); Q?#1 3(NC)* 6(B); Q?#2 3(NC)* 6(B); Q?#3 3(NC)* 6(B); Q?#4 3(NC)* 6(B); Q?#5 3(NC)* 6(B); Q?#6 3(NC)* 6(B); Q?#7 3(NC)* 6(B); Q?#8 3(NC)* 6(B); Q?#9 3(NC)* 6(B); Q?#10 3(NC)* 6(B); Q?#11 3(NC)* 6(B); Q?#12 3(NC)* 6(B); Q?#13 3(NC)* 6(B); Q?#14 3(NC)* 6(B); Q?#15 3(NC)* 6(B)

### Notes on the sheet
- ISOLATION CIRCUIT

### Library data of the parts
Q2 Q?#1-Q?#15 = CMP-22018-000009-1: OPTOISO 2.5KV TRANS W/BASE 6DIP; Isolation Voltage: 5kV; Reverse Breakdown Voltage: 5V; Forward Voltage: 1.5V; Rise Time: 2us; Max Power Dissipation: 250mW; Collector Emitter Breakdown Voltage: 30V; Max Collector Current: 100mA; Collector Emitter Saturation Voltage: 500mV; Power Dissipation: 150mW; Number of Elements: 1; Forward Current: 60mA; Output Voltage: 70V; Input Type: DC; Max Input Current: 80mA; Input Current: 50mA; Current Transfer Ratio: 50%; Number of Pins: 6; Min Operating Temperature: -55°C; Radiation Hardening: No; Case/Package: PDIP; Fall Time: 2us; Lead Free: Lead Free; Series: -; Max Operating Temperature: 100°C; Output Current per Channel: 100mA; Number of Circuits: 1; Collector Emitter Voltage (VCEO): 30V; Isolation Voltage-Max: 5kV; Collector-emitter Voltage-Max: 500mV; Packaging: Rail/Tube; Mount: Through Hole; Package Quantity: 2000; Max Output Voltage: 30V; Number of Channels: 1
R9 R?#6 R?#9 R?#10 R?#13 R?#14 R?#17 R?#18 R?#21 R?#22 R?#25 R?#26 R?#29 R?#30 R?#33 R?#34 = CMP-00030-42824149-1: AC07000001001JAC00 1kΩ 7W -80ppm/℃~-10ppm/℃ ±5% -40℃~+275℃ Axial Leaded Through Hole Resistors ROHS; Temperature Coefficient: -80ppm/°C; Voltage Rating (DC): 84V; Tolerance: 5%; Military Standard: Not; RoHS: Compliant; Diameter: 7.5mm; Radiation Hardening: No; Lead Free: Lead Free; Max Power Dissipation: 7W; Contact Plating: Tin; Number of Terminations: 2; Length: 26mm; Thickness: 7.493mm; Case/Package: Axial; Min Operating Temperature: -40°C; Resistance: 1kΩ; Composition: Wirewound; NexarPartId: 42824149; Max Operating Temperature: 200°C; Voltage Rating: 84V; Number of Pins: 2; Power Rating: 7W; Packaging: Tape & Box (TB); Width: 7.49mm; Features: Flame Retardant Coating; Termination: Axial
R11 R?#5 R?#7 R?#8 R?#11 R?#12 R?#15 R?#16 R?#19 R?#20 R?#23 R?#24 R?#27 R?#28 R?#31 R?#32 = CMP-00030-39746760-1: AC03000003000JAC00 Res Wirewound 300 Ohm 5% 3W -80ppm/C to -10ppm/C Conformal AXL Thru-Hole Ammo Pack; Voltage Rating (DC): 30V; Lead Diameter: 800µm; Temperature Coefficient: -80ppm/°C; Max Operating Temperature: 275°C; Number of Pins: 2; Termination: Axial; Diameter: 4.8mm; Contact Plating: Tin; Packaging: Cut Tape (CT); Schedule B: 8533210080, 8533210080; Voltage Rating: 30V; Military Standard: Not; Max Power Dissipation: 3W; Composition: Wirewound; Power Rating: 3W; NexarPartId: 39746760; Tolerance: 5%; Case/Package: Axial; REACH SVHC: Unknown; Min Operating Temperature: -40°C; Thickness: 4.8006mm; Features: Flame Retardant Coating; Width: 4.8mm; Length: 13mm; RoHS: Compliant; Number of Terminations: 2

## Sheet Opto-Isolation_2.SchDoc
size A2 portrait; SheetNumber: 7; SheetTotal: 6
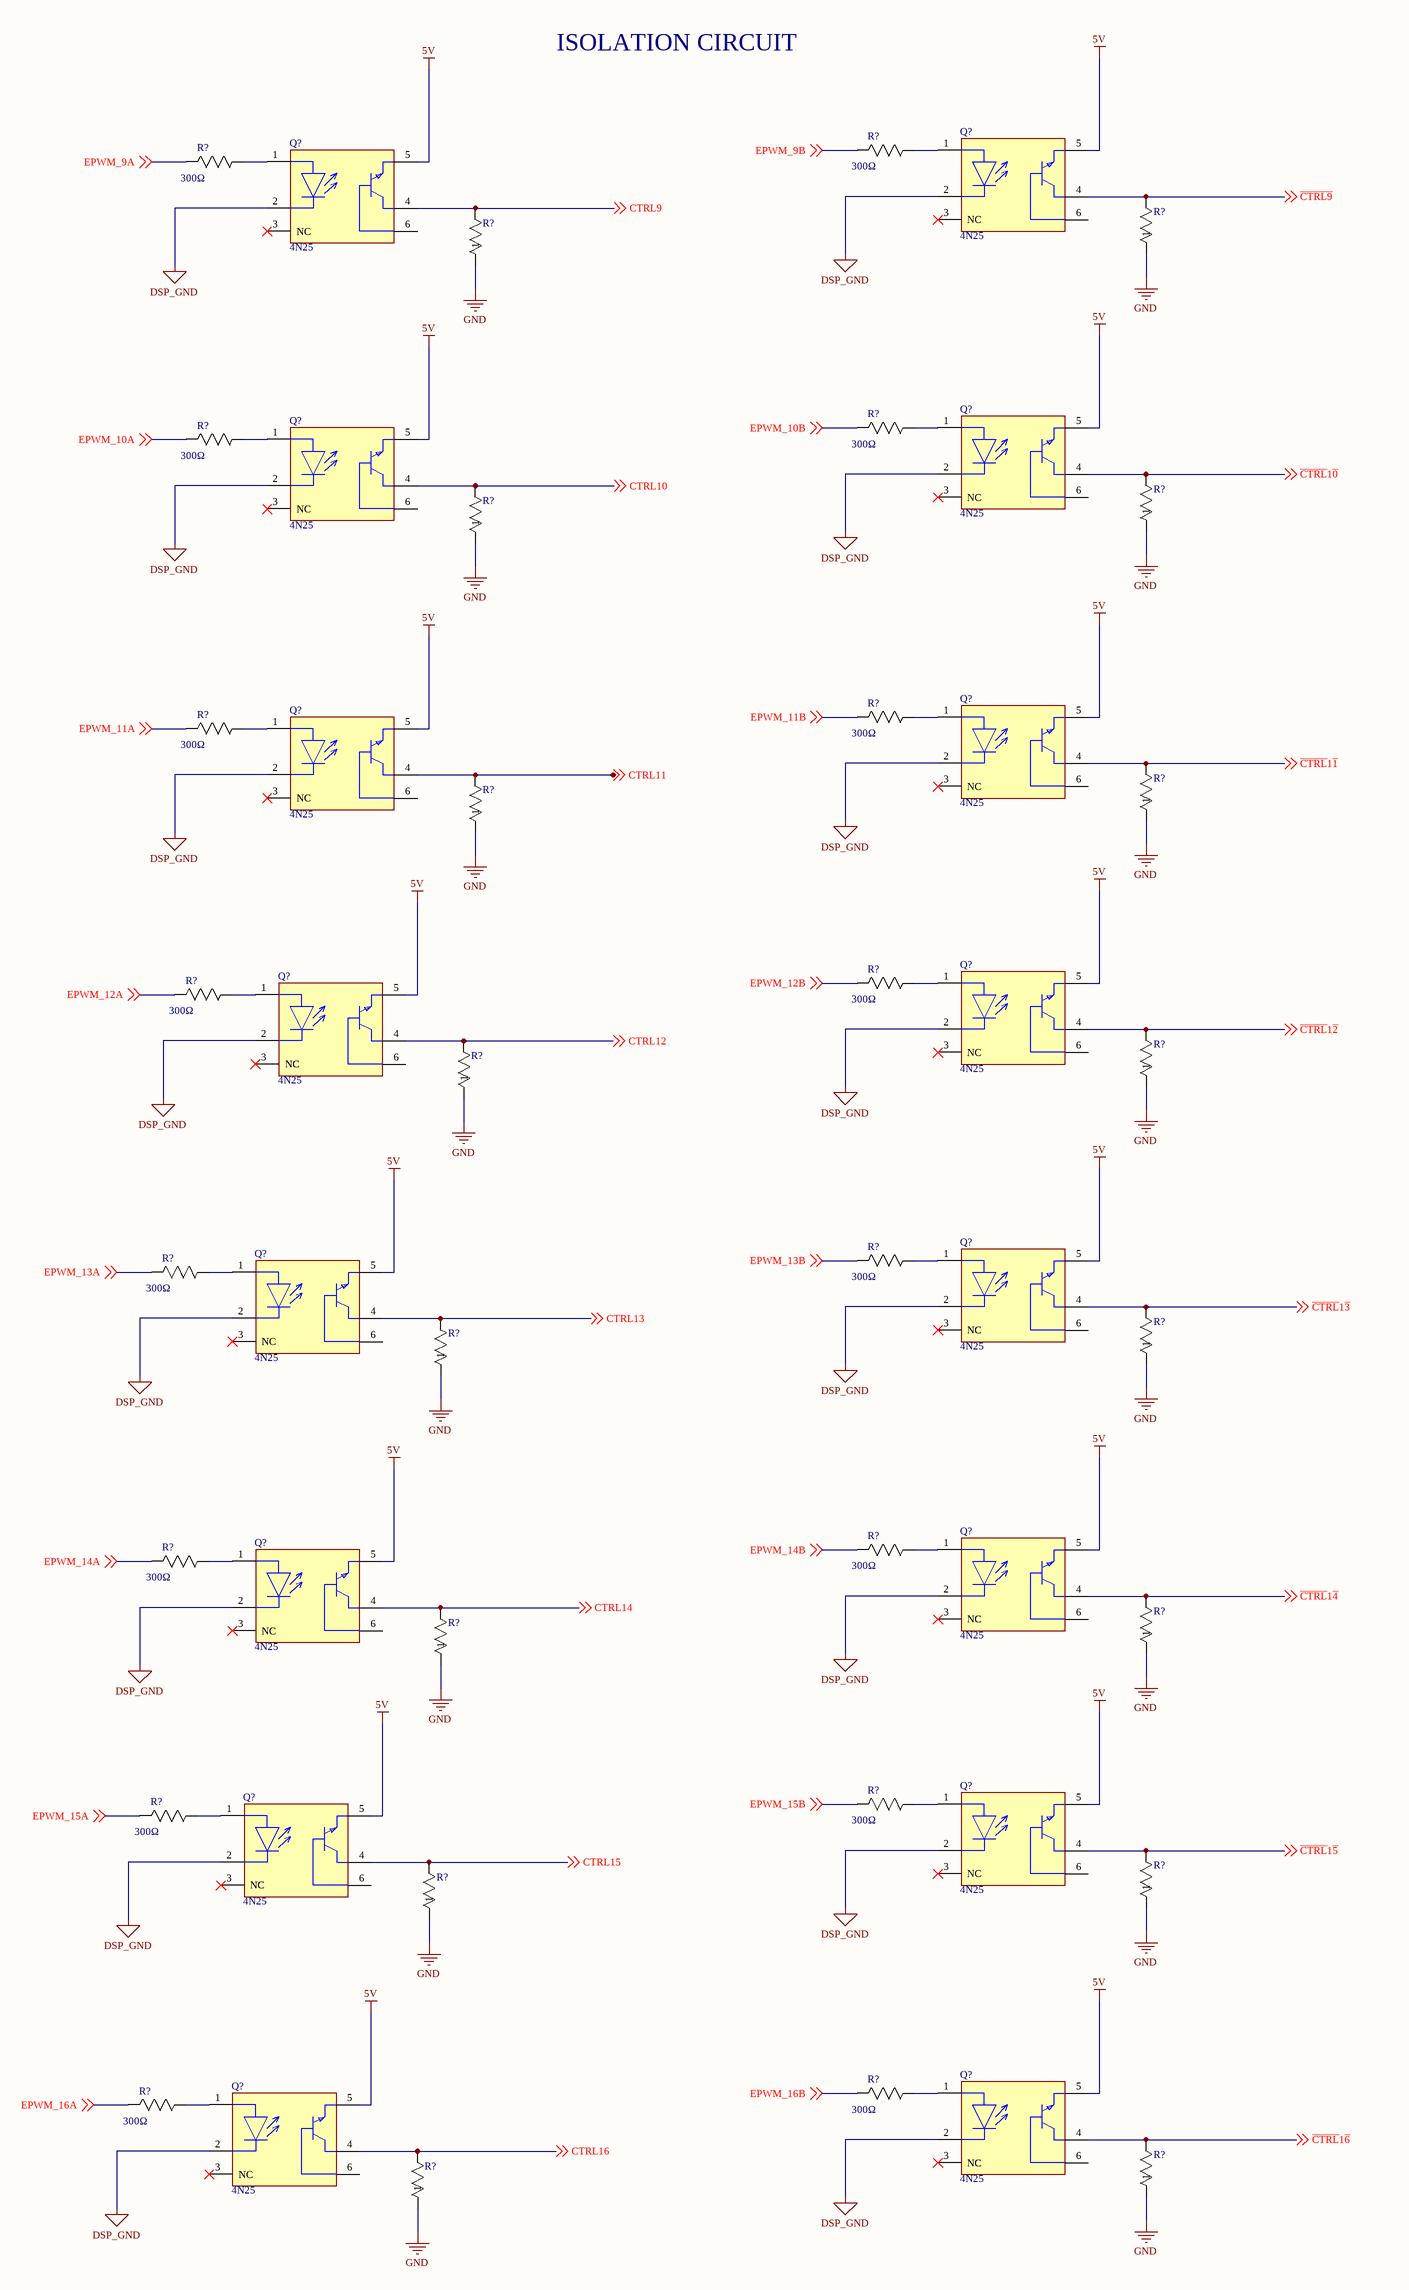
[diagram p5: Opto-Isolation_2.SchDoc]

### Parts
(Parts that share a designator on the sheet are numbered #1, #2 ... from top to bottom, then left to right.)
Q?#16  4N25  [FP-4N25-MFG]
Q?#17  4N25  [FP-4N25-MFG]
Q?#18  4N25  [FP-4N25-MFG]
Q?#19  4N25  [FP-4N25-MFG]
Q?#20  4N25  [FP-4N25-MFG]
Q?#21  4N25  [FP-4N25-MFG]
Q?#22  4N25  [FP-4N25-MFG]
Q?#23  4N25  [FP-4N25-MFG]
Q?#24  4N25  [FP-4N25-MFG]
Q?#25  4N25  [FP-4N25-MFG]
Q?#26  4N25  [FP-4N25-MFG]
Q?#27  4N25  [FP-4N25-MFG]
Q?#28  4N25  [FP-4N25-MFG]
Q?#29  4N25  [FP-4N25-MFG]
Q?#30  4N25  [FP-4N25-MFG]
Q?#31  4N25  [FP-4N25-MFG]
R?#35  Resistance: 300Ω  [RES_AC03_VIS]  (hidden comment: AC03000003000JAC00)
R?#36  Resistance: 300Ω  [RES_AC03_VIS]  (hidden comment: AC03000003000JAC00)
R?#37  AC07000001001JAC00  [RES_AC07_VIS]  (value not drawn)
R?#38  AC07000001001JAC00  [RES_AC07_VIS]  (value not drawn)
R?#39  Resistance: 300Ω  [RES_AC03_VIS]  (hidden comment: AC03000003000JAC00)
R?#40  Resistance: 300Ω  [RES_AC03_VIS]  (hidden comment: AC03000003000JAC00)
R?#41  AC07000001001JAC00  [RES_AC07_VIS]  (value not drawn)
R?#42  AC07000001001JAC00  [RES_AC07_VIS]  (value not drawn)
R?#43  Resistance: 300Ω  [RES_AC03_VIS]  (hidden comment: AC03000003000JAC00)
R?#44  Resistance: 300Ω  [RES_AC03_VIS]  (hidden comment: AC03000003000JAC00)
R?#45  AC07000001001JAC00  [RES_AC07_VIS]  (value not drawn)
R?#46  AC07000001001JAC00  [RES_AC07_VIS]  (value not drawn)
R?#47  Resistance: 300Ω  [RES_AC03_VIS]  (hidden comment: AC03000003000JAC00)
R?#48  Resistance: 300Ω  [RES_AC03_VIS]  (hidden comment: AC03000003000JAC00)
R?#49  AC07000001001JAC00  [RES_AC07_VIS]  (value not drawn)
R?#50  AC07000001001JAC00  [RES_AC07_VIS]  (value not drawn)
R?#51  Resistance: 300Ω  [RES_AC03_VIS]  (hidden comment: AC03000003000JAC00)
R?#52  Resistance: 300Ω  [RES_AC03_VIS]  (hidden comment: AC03000003000JAC00)
R?#53  AC07000001001JAC00  [RES_AC07_VIS]  (value not drawn)
R?#54  AC07000001001JAC00  [RES_AC07_VIS]  (value not drawn)
R?#55  Resistance: 300Ω  [RES_AC03_VIS]  (hidden comment: AC03000003000JAC00)
R?#56  Resistance: 300Ω  [RES_AC03_VIS]  (hidden comment: AC03000003000JAC00)
R?#57  AC07000001001JAC00  [RES_AC07_VIS]  (value not drawn)
R?#58  AC07000001001JAC00  [RES_AC07_VIS]  (value not drawn)
R?#59  Resistance: 300Ω  [RES_AC03_VIS]  (hidden comment: AC03000003000JAC00)
R?#60  Resistance: 300Ω  [RES_AC03_VIS]  (hidden comment: AC03000003000JAC00)
R?#61  AC07000001001JAC00  [RES_AC07_VIS]  (value not drawn)
R?#62  AC07000001001JAC00  [RES_AC07_VIS]  (value not drawn)
R?#63  Resistance: 300Ω  [RES_AC03_VIS]  (hidden comment: AC03000003000JAC00)
R?#64  Resistance: 300Ω  [RES_AC03_VIS]  (hidden comment: AC03000003000JAC00)
R?#65  AC07000001001JAC00  [RES_AC07_VIS]  (value not drawn)
R?#66  AC07000001001JAC00  [RES_AC07_VIS]  (value not drawn)

### Nets
5V: Q?#16.5(C) Q?#17.5(C) Q?#18.5(C) Q?#19.5(C) Q?#20.5(C) Q?#21.5(C) Q?#22.5(C) Q?#23.5(C) Q?#24.5(C) Q?#25.5(C) Q?#26.5(C) Q?#27.5(C) Q?#28.5(C) Q?#29.5(C) Q?#30.5(C) Q?#31.5(C)
DSP_GND: Q?#16.2(C) Q?#17.2(C) Q?#18.2(C) Q?#19.2(C) Q?#20.2(C) Q?#21.2(C) Q?#22.2(C) Q?#23.2(C) Q?#24.2(C) Q?#25.2(C) Q?#26.2(C) Q?#27.2(C) Q?#28.2(C) Q?#29.2(C) Q?#30.2(C) Q?#31.2(C)
GND: R?#37.1 R?#38.1 R?#41.1 R?#42.1 R?#45.1 R?#46.1 R?#49.1 R?#50.1 R?#53.1 R?#54.1 R?#57.1 R?#58.1 R?#61.1 R?#62.1 R?#65.1 R?#66.1
~{CTRL9}: Q?#16.4(E) R?#37.2 ; off-sheet ~{CTRL9}
~{CTRL}1~{0}: Q?#18.4(E) R?#41.2 ; off-sheet ~{CTRL}1~{0}
~{CTRL}1~{1}: Q?#20.4(E) R?#45.2 ; off-sheet ~{CTRL}1~{1}
~{CTRL}1~{2}: Q?#22.4(E) R?#49.2 ; off-sheet ~{CTRL}1~{2}
~{CTRL}1~{3}: Q?#24.4(E) R?#53.2 ; off-sheet ~{CTRL}1~{3}
~{CTRL}1~{4}: Q?#26.4(E) R?#57.2 ; off-sheet ~{CTRL}1~{4}
~{CTRL}1~{5}: Q?#28.4(E) R?#61.2 ; off-sheet ~{CTRL}1~{5}
~{CTRL}1~{6}: Q?#30.4(E) R?#65.2 ; off-sheet ~{CTRL}1~{6}
CTRL9: Q?#17.4(E) R?#38.2 ; off-sheet CTRL9
CTRL10: Q?#19.4(E) R?#42.2 ; off-sheet CTRL10
CTRL11: Q?#21.4(E) R?#46.2 ; off-sheet CTRL11
CTRL12: Q?#23.4(E) R?#50.2 ; off-sheet CTRL12
CTRL13: Q?#25.4(E) R?#54.2 ; off-sheet CTRL13
CTRL14: Q?#27.4(E) R?#58.2 ; off-sheet CTRL14
CTRL15: Q?#29.4(E) R?#62.2 ; off-sheet CTRL15
CTRL16: Q?#31.4(E) R?#66.2 ; off-sheet CTRL16
EPWM_9A: R?#36.1 ; off-sheet EPWM_9A
EPWM_9B: R?#35.1 ; off-sheet EPWM_9B
EPWM_10A: R?#40.1 ; off-sheet EPWM_10A
EPWM_10B: R?#39.1 ; off-sheet EPWM_10B
EPWM_11A: R?#44.1 ; off-sheet EPWM_11A
EPWM_11B: R?#43.1 ; off-sheet EPWM_11B
EPWM_12A: R?#48.1 ; off-sheet EPWM_12A
EPWM_12B: R?#47.1 ; off-sheet EPWM_12B
EPWM_13A: R?#52.1 ; off-sheet EPWM_13A
EPWM_13B: R?#51.1 ; off-sheet EPWM_13B
EPWM_14A: R?#56.1 ; off-sheet EPWM_14A
EPWM_14B: R?#55.1 ; off-sheet EPWM_14B
EPWM_15A: R?#60.1 ; off-sheet EPWM_15A
EPWM_15B: R?#59.1 ; off-sheet EPWM_15B
EPWM_16A: R?#64.1 ; off-sheet EPWM_16A
EPWM_16B: R?#63.1 ; off-sheet EPWM_16B
NetQ?#16_1: Q?#16.1(A) R?#35.2
NetQ?#17_1: Q?#17.1(A) R?#36.2
NetQ?#18_1: Q?#18.1(A) R?#39.2
NetQ?#19_1: Q?#19.1(A) R?#40.2
NetQ?#20_1: Q?#20.1(A) R?#43.2
NetQ?#21_1: Q?#21.1(A) R?#44.2
NetQ?#22_1: Q?#22.1(A) R?#47.2
NetQ?#23_1: Q?#23.1(A) R?#48.2
NetQ?#24_1: Q?#24.1(A) R?#51.2
NetQ?#25_1: Q?#25.1(A) R?#52.2
NetQ?#26_1: Q?#26.1(A) R?#55.2
NetQ?#27_1: Q?#27.1(A) R?#56.2
NetQ?#28_1: Q?#28.1(A) R?#59.2
NetQ?#29_1: Q?#29.1(A) R?#60.2
NetQ?#30_1: Q?#30.1(A) R?#63.2
NetQ?#31_1: Q?#31.1(A) R?#64.2

Not connected (* = marked no-connect by the designer): Q?#16 3(NC)* 6(B); Q?#17 3(NC)* 6(B); Q?#18 3(NC)* 6(B); Q?#19 3(NC)* 6(B); Q?#20 3(NC)* 6(B); Q?#21 3(NC)* 6(B); Q?#22 3(NC)* 6(B); Q?#23 3(NC)* 6(B); Q?#24 3(NC)* 6(B); Q?#25 3(NC)* 6(B); Q?#26 3(NC)* 6(B); Q?#27 3(NC)* 6(B); Q?#28 3(NC)* 6(B); Q?#29 3(NC)* 6(B); Q?#30 3(NC)* 6(B); Q?#31 3(NC)* 6(B)

### Notes on the sheet
- ISOLATION CIRCUIT

### Library data of the parts
Q?#16-Q?#31 = CMP-22018-000009-1: as Q2 on sheet Opto-Isolation_1; Number of Pins: 6; Min Operating Temperature: -55°C; Radiation Hardening: No; Case/Package: PDIP; Fall Time: 2us; Lead Free: Lead Free; Series: -; Max Operating Temperature: 100°C; Output Current per Channel: 100mA; Number of Circuits: 1; Collector Emitter Voltage (VCEO): 30V; Isolation Voltage-Max: 5kV; Collector-emitter Voltage-Max: 500mV; Packaging: Rail/Tube; Mount: Through Hole; Package Quantity: 2000; Max Output Voltage: 30V; Number of Channels: 1
R?#35 R?#36 R?#39 R?#40 R?#43 R?#44 R?#47 R?#48 R?#51 R?#52 R?#55 R?#56 R?#59 R?#60 R?#63 R?#64 = CMP-00030-39746760-1: as R11 on sheet Opto-Isolation_1; Max Operating Temperature: 275°C; Number of Pins: 2; Termination: Axial; Diameter: 4.8mm; Contact Plating: Tin; Packaging: Cut Tape (CT); Schedule B: 8533210080, 8533210080; Voltage Rating: 30V; Military Standard: Not; Max Power Dissipation: 3W; Composition: Wirewound; Power Rating: 3W; NexarPartId: 39746760; Tolerance: 5%; Case/Package: Axial; REACH SVHC: Unknown; Min Operating Temperature: -40°C; Thickness: 4.8006mm; Features: Flame Retardant Coating; Width: 4.8mm; Length: 13mm; RoHS: Compliant; Number of Terminations: 2
R?#37 R?#38 R?#41 R?#42 R?#45 R?#46 R?#49 R?#50 R?#53 R?#54 R?#57 R?#58 R?#61 R?#62 R?#65 R?#66 = CMP-00030-42824149-1: as R9 on sheet Opto-Isolation_1; Tolerance: 5%; Military Standard: Not; RoHS: Compliant; Diameter: 7.5mm; Radiation Hardening: No; Lead Free: Lead Free; Max Power Dissipation: 7W; Contact Plating: Tin; Number of Terminations: 2; Length: 26mm; Thickness: 7.493mm; Case/Package: Axial; Min Operating Temperature: -40°C; Resistance: 1kΩ; Composition: Wirewound; NexarPartId: 42824149; Max Operating Temperature: 200°C; Voltage Rating: 84V; Number of Pins: 2; Power Rating: 7W; Packaging: Tape & Box (TB); Width: 7.49mm; Features: Flame Retardant Coating; Termination: Axial

## Nets that join several sheets
3V3: Buck_Converters (20uH-1.2 C?#5.2), ADC_LEVEL_SHIFT (C1.1 R2.1 U1.7)
5V: Buck_Converters (20uH.2 C?#2.2), Opto-Isolation_1 (16 pins), Opto-Isolation_2 (16 pins)
DSP_GND: DSP connections (JP1.4 JP1.10 JP2.4 JP2.10), Opto-Isolation_1 (16 pins), Opto-Isolation_2 (16 pins)
GND: Buck_Converters (15 pins), Voltage_Protection (D1.2), ADC_LEVEL_SHIFT (C1.2 R3.2 R4.1 U1.4), Opto-Isolation_1 (16 pins), Opto-Isolation_2 (16 pins)
ADCIN0: DSP connections (JP3.9), Voltage_Protection (R7.2)
ADCIN_0: Voltage_Protection (D1.1 R7.1), ADC_LEVEL_SHIFT (U1.6)
EPWM_1A: DSP connections (JP1.11), Opto-Isolation_1 (R11.1)
EPWM_1B: DSP connections (JP1.1), Opto-Isolation_1 (R?#5.1)
EPWM_2A: DSP connections (JP1.12), Opto-Isolation_1 (R?#8.1)
EPWM_2B: DSP connections (JP1.2), Opto-Isolation_1 (R?#7.1)
EPWM_3A: DSP connections (JP1.13), Opto-Isolation_1 (R?#12.1)
EPWM_3B: DSP connections (JP1.3), Opto-Isolation_1 (R?#11.1)
EPWM_4A: DSP connections (JP1.15), Opto-Isolation_1 (R?#16.1)
EPWM_4B: DSP connections (JP1.5), Opto-Isolation_1 (R?#15.1)
EPWM_5A: DSP connections (JP1.16), Opto-Isolation_1 (R?#20.1)
EPWM_5B: DSP connections (JP1.6), Opto-Isolation_1 (R?#19.1)
EPWM_6A: DSP connections (JP1.17), Opto-Isolation_1 (R?#24.1)
EPWM_6B: DSP connections (JP1.7), Opto-Isolation_1 (R?#23.1)
EPWM_7A: DSP connections (JP1.18), Opto-Isolation_1 (R?#28.1)
EPWM_7B: DSP connections (JP1.8), Opto-Isolation_1 (R?#27.1)
EPWM_8A: DSP connections (JP1.19), Opto-Isolation_1 (R?#32.1)
EPWM_8B: DSP connections (JP1.9), Opto-Isolation_1 (R?#31.1)
EPWM_9A: DSP connections (JP2.11), Opto-Isolation_2 (R?#36.1)
EPWM_9B: DSP connections (JP2.1), Opto-Isolation_2 (R?#35.1)
EPWM_10A: DSP connections (JP2.12), Opto-Isolation_2 (R?#40.1)
EPWM_10B: DSP connections (JP2.2), Opto-Isolation_2 (R?#39.1)
EPWM_11A: DSP connections (JP2.13), Opto-Isolation_2 (R?#44.1)
EPWM_11B: DSP connections (JP2.3), Opto-Isolation_2 (R?#43.1)
EPWM_12A: DSP connections (JP2.15), Opto-Isolation_2 (R?#48.1)
EPWM_12B: DSP connections (JP2.5), Opto-Isolation_2 (R?#47.1)
EPWM_13A: DSP connections (JP2.16), Opto-Isolation_2 (R?#52.1)
EPWM_13B: DSP connections (JP2.6), Opto-Isolation_2 (R?#51.1)
EPWM_14A: DSP connections (JP2.17), Opto-Isolation_2 (R?#56.1)
EPWM_14B: DSP connections (JP2.7), Opto-Isolation_2 (R?#55.1)
EPWM_15A: DSP connections (JP2.18), Opto-Isolation_2 (R?#60.1)
EPWM_15B: DSP connections (JP2.8), Opto-Isolation_2 (R?#59.1)
EPWM_16A: DSP connections (JP2.19), Opto-Isolation_2 (R?#64.1)
EPWM_16B: DSP connections (JP2.9), Opto-Isolation_2 (R?#63.1)